# Altium schematic sheet SX1276_e268v01a.SchDoc
size A3
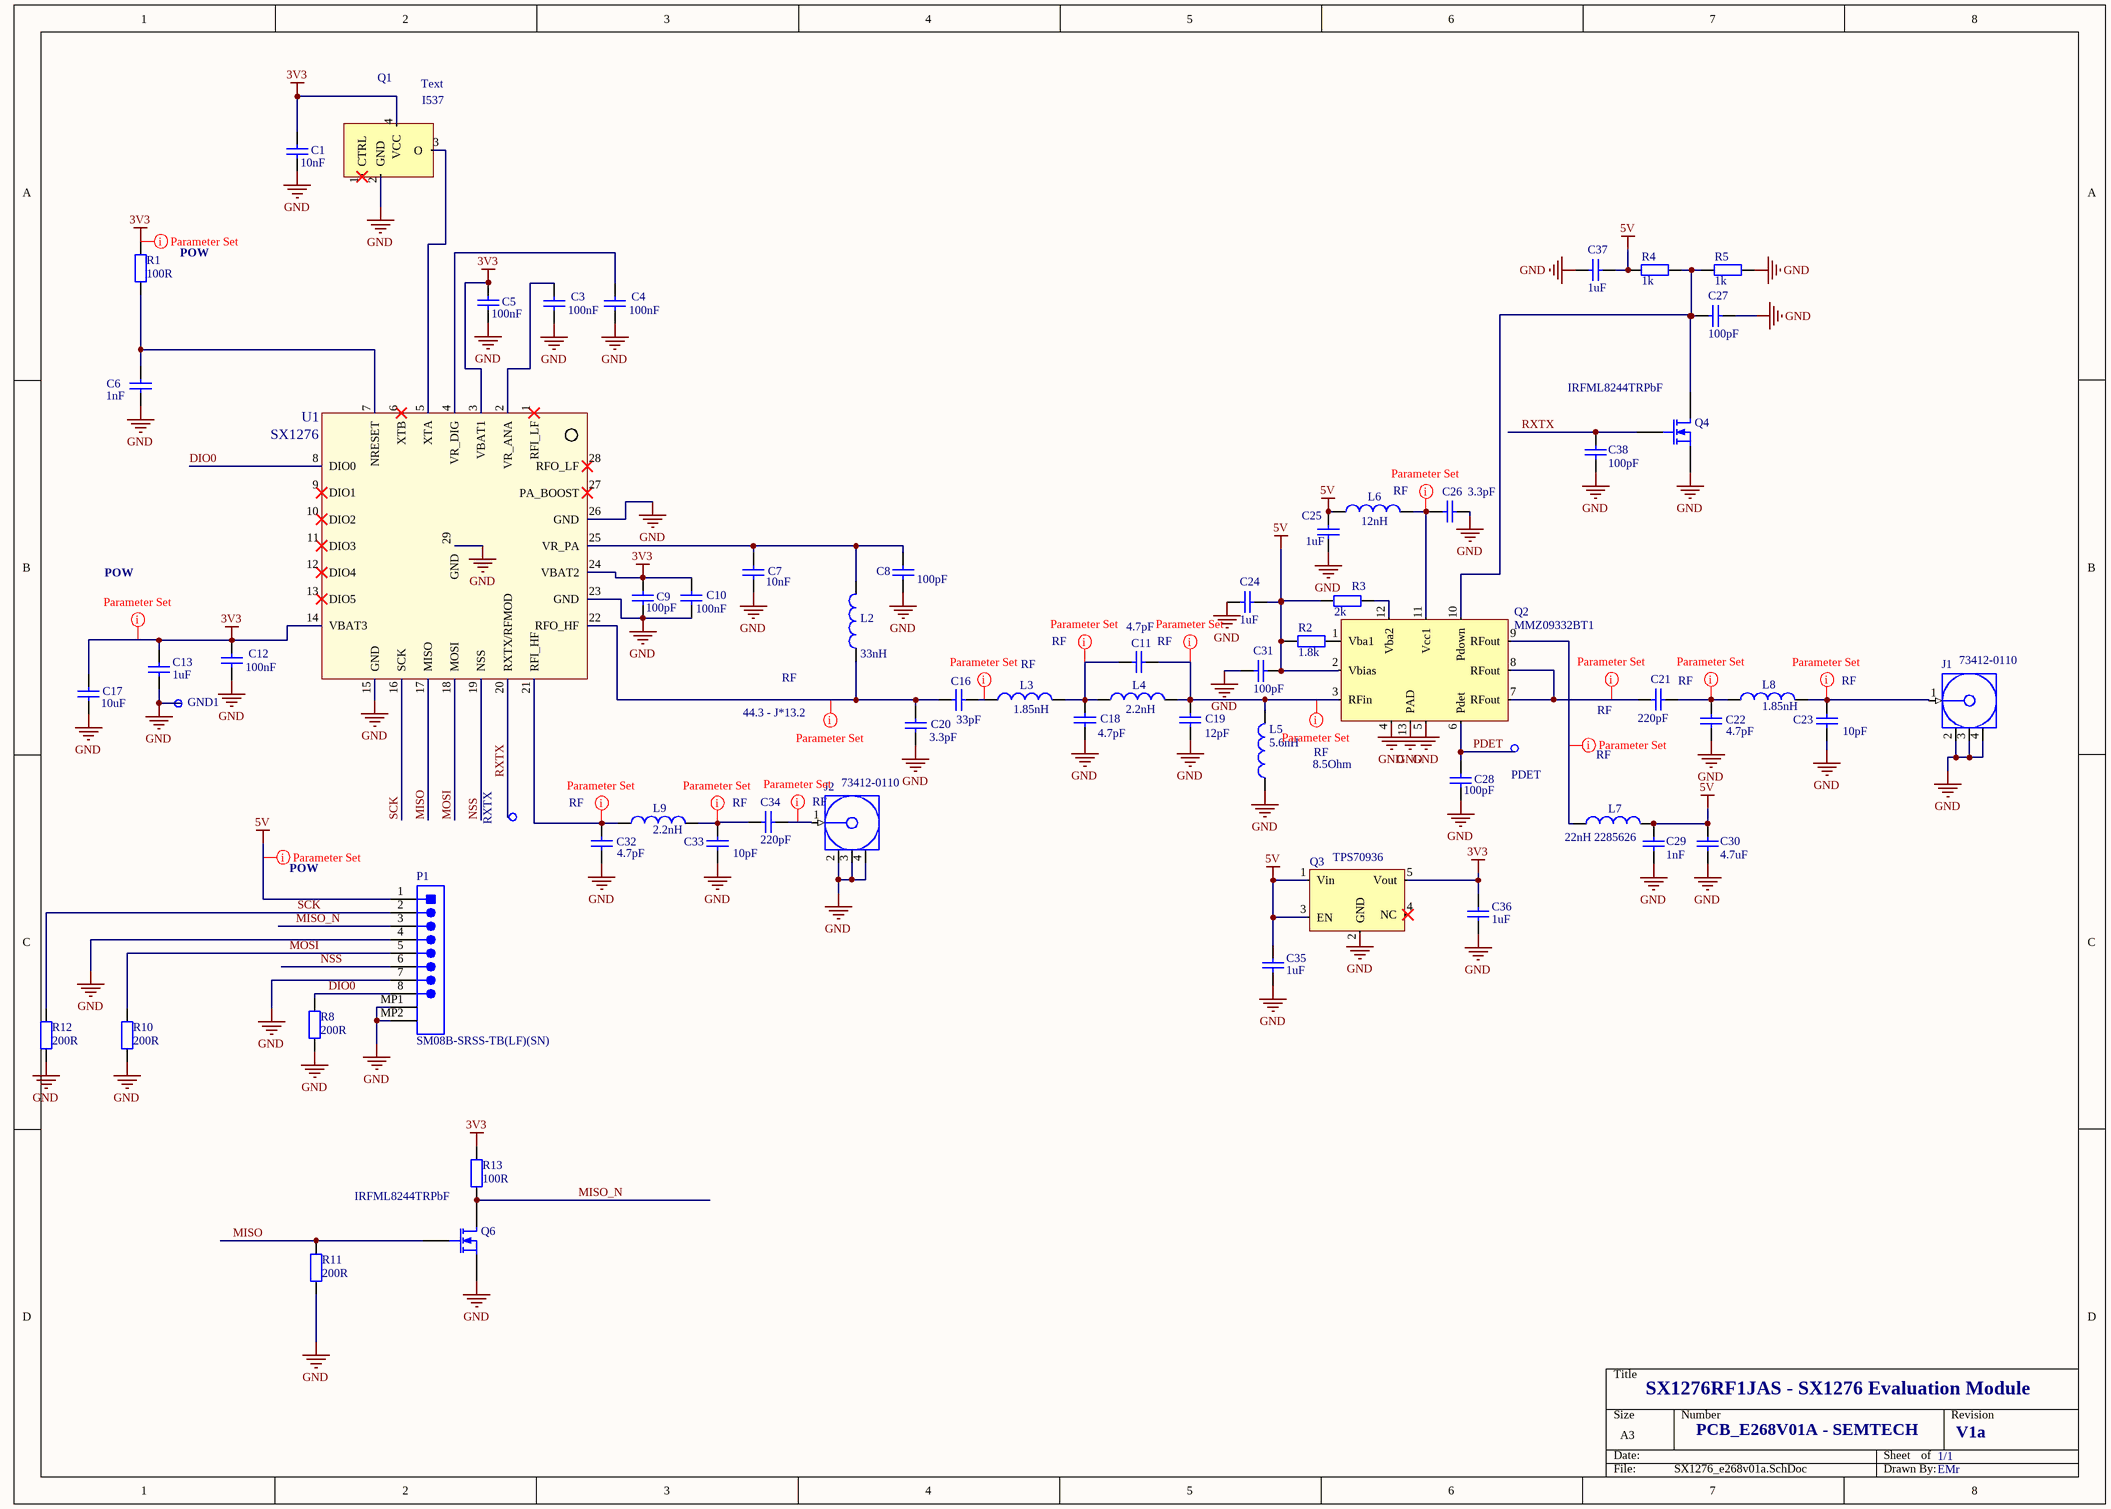
[diagram p0: SX1276_e268v01a.SchDoc]

## Parts
C1  value 10nF  [rlc_402_smd]  (hidden comment: Cap)
C3  value 100nF  [rlc_402_smd]  (hidden comment: Cap)
C4  value 100nF  [rlc_402_smd]  (hidden comment: Cap)
C5  value 100nF  [rlc_402_smd]  (hidden comment: Cap)
C6  value 1nF  [rlc_402_smd]  (hidden comment: Cap)
C7  value 10nF  [rlc_402_smd]  (hidden comment: Cap)
C8  value 100pF  [rlc_402_smd]  (hidden comment: Cap)
C9  value 100pF  [rlc_402_smd]  (hidden comment: Cap)
C10  value 100nF  [rlc_402_smd]  (hidden comment: Cap)
C11  value 4.7pF  [rlc_402_smd]  (hidden comment: Cap)
C12  value 100nF  [rlc_402_smd]  (hidden comment: Cap)
C13  value 1uF  [rlc_603_smd]  (hidden comment: Cap Semi)
C16  value 33pF  [rlc_402_smd]  (hidden comment: Cap)
C17  value 10uF  [rlc_805_smd]  (hidden comment: Cap)
C18  value 4.7pF  [rlc_402_smd]  (hidden comment: Cap)
C19  value 12pF  [rlc_402_smd]  (hidden comment: Cap)
C20  value 3.3pF  [rlc_402_smd]  (hidden comment: Cap)
C21  value 220pF  [rlc_402_smd]  (hidden comment: Cap)
C22  value 4.7pF  [rlc_402_smd]  (hidden comment: Cap)
C23  value 10pF  [rlc_402_smd]  (hidden comment: Cap)
C24  value 1uF  [rlc_603_smd]  (hidden comment: Cap)
C25  value 1uF  [rlc_603_smd]  (hidden comment: Cap)
C26  value 3.3pF  [rlc_402_smd]  (hidden comment: Cap)
C27  value 100pF  [rlc_402_smd]  (hidden comment: Cap)
C28  value 100pF  [rlc_402_smd]  (hidden comment: Cap)
C29  value 1nF  [rlc_402_smd]  (hidden comment: Cap)
C30  value 4.7uF  [rlc_603_smd]  (hidden comment: Cap)
C31  value 100pF  [rlc_402_smd]  (hidden comment: Cap)
C32  value 4.7pF  [rlc_402_smd]  (hidden comment: Cap)
C33  value 10pF  [rlc_402_smd]  (hidden comment: Cap)
C34  value 220pF  [rlc_402_smd]  (hidden comment: Cap)
C35  value 1uF  [rlc_603_smd]  (hidden comment: Cap Semi)
C36  value 1uF  [rlc_603_smd]  (hidden comment: Cap Semi)
C37  value 1uF  [rlc_603_smd]  (hidden comment: Cap)
C38  value 100pF  [rlc_402_smd]  (hidden comment: Cap)
GND1  Test Pin  [pin_1mm]  (value not drawn)
J1  73412-0110  [MOLX-73412-0110_V]
J2  73412-0110  [MOLX-73412-0110_V]
L2  value 33nH  [rlc_402_smd]  (hidden comment: Inductor)
L3  value 1.85nH  [rlc_402_smd]  (hidden comment: Inductor)
L4  value 2.2nH  [rlc_402_smd]  (hidden comment: Inductor)
L5  value 5.6nH  [rlc_402_smd]  (hidden comment: Inductor)
L6  value 12nH  [rlc_402_smd]  (hidden comment: Inductor)
L7  value 22nH 2285626  [rlc_402_smd]  (hidden comment: Inductor)
L8  value 1.85nH  [rlc_402_smd]  (hidden comment: Inductor)
L9  value 2.2nH  [rlc_402_smd]  (hidden comment: Inductor)
P1  SM08B-SRSS-TB(LF)(SN)  [JST-SM08B-SRSS-TB_V]
PDET  Test Pin  [pin_SMD]  (value not drawn)
Q1  I537  [nd3225da]
Q2  MMZ09332BT1  [QFN3_3]
Q3  TPS70936  [SOT-23-5]
Q4  IRFML8244TRPbF  [SOT23_MOSFET]
Q6  IRFML8244TRPbF  [SOT23_MOSFET]
R1  value 100R  [rlc_402_smd]  (hidden comment: Resistor)
R2  value 1.8k  [rlc_402_smd]  (hidden comment: Resistor)
R3  value 2k  [rlc_402_smd]  (hidden comment: Resistor)
R4  value 1k  [rlc_402_smd]  (hidden comment: Resistor)
R5  value 1k  [rlc_402_smd]  (hidden comment: Resistor)
R8  value 200R  [rlc_402_smd]  (hidden comment: Resistor)
R10  value 200R  [rlc_402_smd]  (hidden comment: Resistor)
R11  value 200R  [rlc_402_smd]  (hidden comment: Resistor)
R12  value 200R  [rlc_402_smd]  (hidden comment: Resistor)
R13  value 100R  [rlc_402_smd]  (hidden comment: Resistor)
RXTX  Test Pin  [pin_SMD]  (value not drawn)
U1  SX1276  [vqfn28_6x6mm]

## Nets
3V3: C1.2 C5.2 C9.2 C10.2 C12.2 C13.2 C17.2 C36.2 Q1.4(VCC) Q3.5(Vout) R1.2 R13.1 U1.3(VBAT1) U1.14(VBAT3) U1.24(VBAT2)
5V: C24.1 C25.2 C29.2 C30.2 C31.2 C35.2 C37.1 L6.1 L7.2 P1.1 Q2.2(Vbias) Q3.1(Vin) Q3.3(EN) R2.2 R3.2 R4.2
GND: C1.1 C3.1 C4.1 C5.1 C6.2 C7.1 C8.1 C9.1 C10.1 C12.1 C13.1 C17.1 C18.1 C19.1 C20.1 C22.1 C23.1 C24.2 C25.1 C26.2 C27.1 C28.1 C29.1 C30.1 C31.1 C32.1 C33.1 C35.1 C36.1 C37.2 C38.2 GND1.1(pin) J1.2(GND) J1.3(GND) J1.4(GND) J2.2(GND) J2.3(GND) J2.4(GND) L5.1 P1.4 P1.7 P1.MP1 P1.MP2 Q1.2(GND) Q2.4 Q2.5 Q2.13(PAD) Q3.2(GND) Q4.S Q6.S R5.1 R8.2 R10.2 R11.2 R12.2 U1.15(GND) U1.23(GND) U1.26(GND) U1.29(GND)
DIO0: P1.8 R8.1 U1.8(DIO0)
MISO: Q6.G R11.1 U1.17(MISO)
MISO_N: P1.3 Q6.D R13.2
MOSI: P1.5 R10.1 U1.18(MOSI)
NSS: P1.6 U1.19(NSS)
PDET: C28.2 PDET.1(pin) Q2.6(Pdet)
RXTX: C38.1 Q4.G RXTX.1(pin) U1.20(RXTX/RFMOD)
SCK: P1.2 R12.1 U1.16(SCK)
NetC3_2: C3.2 U1.2(VR_ANA)
NetC4_2: C4.2 U1.4(VR_DIG)
NetC6_1: C6.1 R1.1 U1.7(NRESET)
NetC7_2: C7.2 C8.2 L2.2 U1.25(VR_PA)
NetC11_1: C11.1 C19.2 L4.2 L5.2 Q2.3(RFin)
NetC11_2: C11.2 C18.2 L3.2 L4.1
NetC16_1: C16.1 L3.1
NetC16_2: C16.2 C20.2 L2.1 U1.22(RFO_HF)
NetC21_1: C21.1 C22.2 L8.1
NetC21_2: C21.2 Q2.7(RFout) Q2.8(RFout)
NetC23_2: C23.2 J1.1(SIGNAL) L8.2
NetC26_1: C26.1 L6.2 Q2.11(Vcc1)
NetC27_2: C27.2 Q2.10(Pdown) Q4.D R4.1 R5.2
NetC32_2: C32.2 L9.1 U1.21(RFI_HF)
NetC33_2: C33.2 C34.2 L9.2
NetC34_1: C34.1 J2.1(SIGNAL)
NetL7_1: L7.1 Q2.9(RFout)
NetQ1_3: Q1.3(O) U1.5(XTA)
NetQ2_1: Q2.1(Vba1) R2.1
NetQ2_12: Q2.12(Vba2) R3.1

Not connected (* = marked no-connect by the designer): Q1 1(CTRL)*; Q3 4(NC)*; U1 1(RFI_LF)* 6(XTB)* 9(DIO1)* 10(DIO2)* 11(DIO3)* 12(DIO4)* 13(DIO5)* 27(PA_BOOST)* 28(RFO_LF)*

## Layout directives
net class RF; Z: 44.3 - J*13.2: NetC16_2
net class RF: NetC11_1, NetC11_2, NetC16_1, NetC21_1, NetC21_2, NetC23_2, NetC26_1, NetC32_2, NetC33_2, NetC34_1, NetL7_1
net class POW: 3V3, 5V
net class RF; Z: 8.5Ohm: NetC11_1

## Notes on the sheet
- SX1276RF1JAS - SX1276 Evaluation Module
- PCB_E268V01A - SEMTECH
- 1/1
- V1a
- EMr
- (in symbol TCXO) Text

## Library data of the parts
C1 C3-C12 C16-C34 C37 C38 = Cap: Capacitor SMD; Published: 8-Jun-2000; LatestRevisionDate: 05-oct-2007  -  Semtech; LatestRevisionNote: Re-released for DXP Platform.; Publisher: Altium Limited
C13 C35 C36 = Cap Semi: Capacitor (Semiconductor SIM Model); Published: 8-Jun-2000; LatestRevisionDate: 05-oct-2007  -  Semtech; LatestRevisionNote: Re-released for DXP Platform.; Publisher: Altium Limited
GND1 PDET RXTX = test_pin: LatestRevisionDate: 05-oct-2007  -  Semtech
J1 J2 = CMP-1676-00003-1: MCRF, PCB Vertical Jack Receptacle, 50 Ohm, 4-Pin SMD, RoHS, Tape and Reel; Voltage Rating (AC): 60 V; Mating Cycles: 30; Impedance: 50 Ohm; Frequency: 6 Hz; Gender: Female; RoHSCompliant: true; Length: 3 mm; DatasheetVersion: 04/2016; ComponentLink3URL: http://www.molex.com/pdm_docs/sd/734120110_sd.pdf; Max Operating Temperature: 90 degC; Contact Material: Bronze; Mount: Surface Mount; ComponentLink2Description: Datasheet; Packaging: Tape and Reel; Radiation Hardening: No; Voltage Rating: 60 V; Mounting Technology: Surface Mount; ComponentLink1Description: Manufacturer URL; ComponentLink1URL: http://www.molex.com/; Width: 3 mm; ComponentLink3Description: Package Specification; Package Quantity: 5000; PackageReference: 73412-0110; Min Operating Temperature: -40 degC; Height: 1.25 mm; REACH SVHC: Unknown; ComponentLink2URL: http://www.molex.com/webdocs/datasheets/pdf/en-us/0734120110_RF_COAX_CONNECTORS.pdf; Contact Plating: Gold; PackageDescription: 4-Leads SMD, Body 2.6 x 2.6 mm; PackageVersion: Rev. C14, 07/2015
L2-L9 = Inductor: Inductor SMD; Code_IEC: 1005; Published: 8-Jun-2000; LatestRevisionDate: 05-oct-2007  -  Semtech; LatestRevisionNote: Re-released for DXP Platform.; Publisher: Altium Limited; Code_JEITA: 0402
P1 = CMP-2000-07082-1: Male Header, Pitch 1 mm, 1 x 8 Position, Height 2.95 mm, -25 to 85 degC, RoHS, Tape and Reel; Manufacturer: JST; Style/Orientation: RightAngleHeader/Plug; Pitch: 1mm; No of Positions: 8; Manufacturer URL: http://www.jst.com/home2.html; Mounting Technology: SurfaceMount; Package Description: Male Header, Pitch 1 mm, 1 x 8 Position, Height 2.95 mm; Datasheet URL: http://www.jst-mfg.com/product/pdf/eng/eSR.pdf; Type: ShroudedHeader; Termination: Crimp; Package Reference: SM08B-SRSS-TB; Datasheet Version: 11/2010
Q1 = TCXO: Termally Compensated External Oscillator
Q3 = RT9086
Q4 Q6 = MOSFET-N: N-Channel MOSFET; Published: 8-Jun-2000; LatestRevisionDate: 17-Jul-2002; LatestRevisionNote: Re-released for DXP Platform.; PackageVersion: 1995/1996; PackageReference: E3; Publisher: Altium Limited; PackageDescription: TO, Flat Index; 3 In-Line, Axial Leads; Body Dia. 4.6mm; Lead Dia. 0.5 mm (max)
R1-R5 R8 R10-R13 = Resistor: Resistor SMD - IEC symbol version; LatestRevisionDate: 27-Jul-20  -  Semtech
U1 = SX1276: SX1276 - Low Power Integrated UHF Transceiver with loRa Modem; LatestRevisionDate: 27-Jul-2009 -  Semtech